# EAGLE design SparkFun_Thing_Plus_ESP32_WROOM_C (EAGLE 9.6.2)
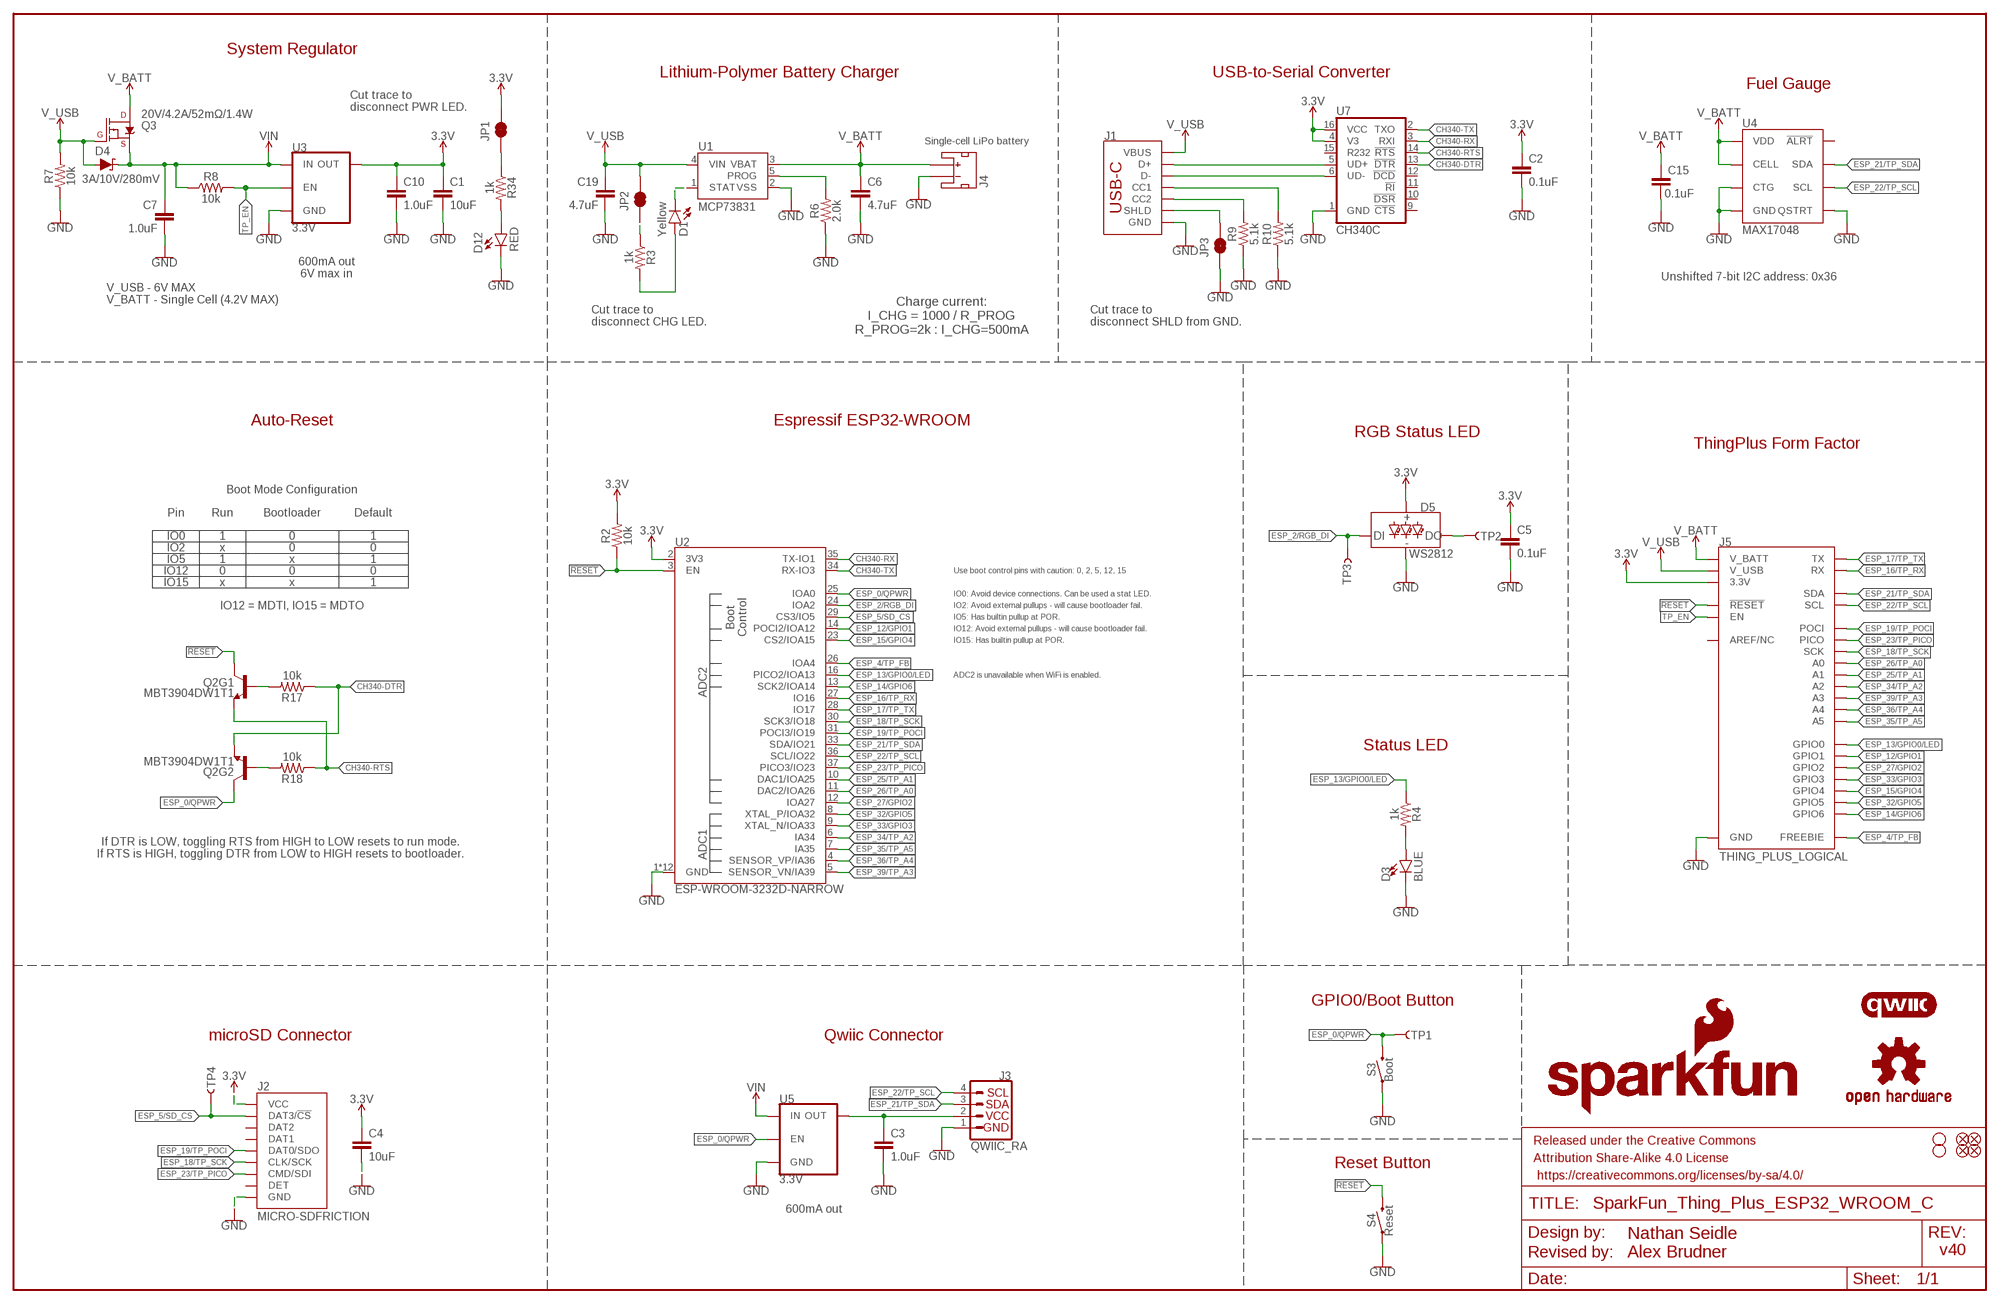
[diagram p0: schematic, sheet 1]

## Parts
C1  10uF  10UF-0402T-6.3V-20%  [0402-TIGHT]
C2  0.1uF  0.1UF-0402T-6.3V-10%-X7R  [0402-TIGHT]
C3  1.0uF  1.0UF-0402T-16V-10%  [0402-TIGHT]
C4  10uF  10UF-0402T-6.3V-20%  [0402-TIGHT]
C5  0.1uF  0.1UF-0402T-6.3V-10%-X7R  [0402-TIGHT]
C6  4.7uF  4.7UF-0402_TIGHT-6.3V-20%-X5R  [0402-TIGHT]
C7  1.0uF  1.0UF-0402T-16V-10%  [0402-TIGHT]
C10  1.0uF  1.0UF-0402T-16V-10%  [0402-TIGHT]
C15  0.1uF  0.1UF-0402T-16V-10%  [0402-TIGHT]
C19  4.7uF  4.7UF-0603-35V-(20%)  [0603]
D1  Yellow  LED-YELLOW0603  [LED-0603]
D3  BLUE  LED-BLUE0603  [LED-0603]
D4  3A/10V/280mV  DIODE-SCHOTTKY-BAT60A  [SOD-323]
D5  WS2812  WS2812_2020  [WS2812-2020]
D12  RED  LED-RED0603  [LED-0603]
FD1  FIDUCIALUFIDUCIAL  [FIDUCIAL-MICRO]
FD2  FIDUCIALUFIDUCIAL  [FIDUCIAL-MICRO]
FD3  FIDUCIALUFIDUCIAL  [FIDUCIAL-MICRO]
FD4  FIDUCIALUFIDUCIAL  [FIDUCIAL-MICRO]
FRAME1  FRAME-LEDGER  [CREATIVE_COMMONS]
H1  STAND-OFFTIGHT  [STAND-OFF-TIGHT]
H2  STAND-OFFTIGHT  [STAND-OFF-TIGHT]
J1  USB_C_2-LAYER_PADS  [USB-C-16P-2LAYER-PADS]
J2  MICRO-SDFRICTION  [MICROSD_TINY]
J3  QWIIC_RA  QWIIC_CONNECTORJS-1MM  [JST04_1MM_RA]
J4  JST_2MM_MALE  [JST-2-SMD]
J5  THING_PLUS_LOGICAL  [THING_PLUS]
JP1  JUMPER-SMT_2_NC_TRACE_SILK  [SMT-JUMPER_2_NC_TRACE_SILK]
JP2  JUMPER-SMT_2_NC_TRACE_SILK  [SMT-JUMPER_2_NC_TRACE_SILK]
JP3  JUMPER-SMT_2_NC_TRACE_SILK  [SMT-JUMPER_2_NC_TRACE_SILK]
LOGO1  SFE_LOGO_NAME_FLAME.1_INCH  [SFE_LOGO_NAME_FLAME_.1]
LOGO2  OSHW-LOGOMINI  [OSHW-LOGO-MINI]
LOGO4  QWIIC_LOGO_4MM  [QWIIC_4MM]
Q2  MBT3904DW1T1  TRANS_NPN_DUAL-MBT3904DW1T1  [SC70-6]
Q3  20V/4.2A/52mΩ/1.4W  MOSFET_PCH-DMG2305UX-7  [SOT23-3]
R2  10k  10KOHM-0402T-1/16W-1%  [0402-TIGHT]
R3  1k  1KOHM-0402T-1/16W-1%  [0402-TIGHT]
R4  1k  1KOHM-0402T-1/16W-1%  [0402-TIGHT]
R6  2.0k  2.0KOHM-0603-1/10W-5%  [0603]
R7  10k  10KOHM-0402T-1/16W-1%  [0402-TIGHT]
R8  10k  10KOHM-0402T-1/16W-1%  [0402-TIGHT]
R9  5.1k  5.1KOHM-0402T-1/16W-1%  [0402-TIGHT]
R10  5.1k  5.1KOHM-0402T-1/16W-1%  [0402-TIGHT]
R17  10k  10KOHM-0402T-1/16W-1%  [0402-TIGHT]
R18  10k  10KOHM-0402T-1/16W-1%  [0402-TIGHT]
R34  1k  1KOHM-0402T-1/16W-1%  [0402-TIGHT]
S3  Boot  MOMENTARY-SWITCH-SPST-SMD-4.6X2.8MM  [TACTILE_SWITCH_SMD_4.6X2.8MM]
S4  Reset  MOMENTARY-SWITCH-SPST-SMD-4.6X2.8MM  [TACTILE_SWITCH_SMD_4.6X2.8MM]
TP1  TEST-POINT3X5  [PAD.03X.05]
TP2  TEST-POINT3X5  [PAD.03X.05]
TP3  TEST-POINT3X5  [PAD.03X.05]
TP4  TEST-POINT3X5  [PAD.03X.05]
U1  MCP73831  [SOT23-5]
U2  ESP-WROOM-3232D-NARROW  [ESP-WROOM-32D-NARROW]
U3  3.3V  V_REG_AP2112K-3.3V  [SOT23-5]
U4  MAX17048  MAX17048DFN8  [DFN-8]
U5  3.3V  V_REG_AP2112K-3.3V  [SOT23-5]
U7  CH340C  [SO016]

## Nets
3.3V [power]: C1.1 C2.1 C4.1 C5.1 C10.1 D5.VCC J2.4(VCC) J5.27(3.3V) JP1.2 R2.2 U2.2(3V3) U3.5(OUT) U7.4(V3) U7.16(VCC)
!RESET!: J5.28(!RESET) Q2.3(C) R2.1 S4.3 S4.4 U2.3(EN)
CH340-DTR: Q2.1(E) R17.1 U7.13(!DTR)
CH340-RTS: Q2.4(E) R18.1 U7.14(!RTS)
CH340-RX: U2.35(TX-IO1) U7.3(RXI)
CH340-TX: U2.34(RX-IO3) U7.2(TXO)
CHG_LED: D1.A R3.2
D+: J1.A6(D+) J1.B6(D+) U7.5(UD+)
D-: J1.A7(D-) J1.B7(D-) U7.6(UD-)
DTR-10K: Q2.5(B) R17.2
ESP_0/QPWR: Q2.6(C) S3.3 S3.4 TP1.1 U2.25(IOA0) U5.3(EN)
ESP_2/RGB_DI: D5.DI TP3.1 U2.24(IOA2)
ESP_4/TP_FB: J5.13(FREEBIE) U2.26(IOA4)
ESP_5/SD_CS: J2.2(DAT3/!CS!) TP4.1 U2.29(CS3/IO5)
ESP_12/GPIO1: J5.8(GPIO1) U2.14(POCI2/IOA12)
ESP_13/GPIO0/LED: J5.9(GPIO0) R4.1 U2.16(PICO2/IOA13)
ESP_14/GPIO6: J5.3(GPIO6) U2.13(SCK2/IOA14)
ESP_15/GPIO4: J5.5(GPIO4) U2.23(CS2/IOA15)
ESP_16/TP_RX: J5.15(RX) U2.27(IO16)
ESP_17/TP_TX: J5.14(TX) U2.28(IO17)
ESP_18/TP_SCK: J2.5(CLK/SCK) J5.18(SCK) U2.30(SCK3/IO18)
ESP_19/TP_POCI: J2.7(DAT0/SDO) J5.16(POCI) U2.31(POCI3/IO19)
ESP_21/TP_SDA: J3.3 J5.1(SDA) U2.33(SDA/IO21) U4.8(SDA)
ESP_22/TP_SCL: J3.4 J5.2(SCL) U2.36(SCL/IO22) U4.7(SCL)
ESP_23/TP_PICO: J2.3(CMD/SDI) J5.17(PICO) U2.37(PICO3/IO23)
ESP_25/TP_A1: J5.23(A1) U2.10(DAC1/IOA25)
ESP_26/TP_A0: J5.24(A0) U2.11(DAC2/IOA26)
ESP_27/GPIO2: J5.7(GPIO2) U2.12(IOA27)
ESP_32/GPIO5: J5.4(GPIO5) U2.8(XTAL_P/IOA32)
ESP_33/GPIO3: J5.6(GPIO3) U2.9(XTAL_N/IOA33)
ESP_34/TP_A2: J5.22(A2) U2.6(IA34)
ESP_35/TP_A5: J5.19(A5) U2.7(IA35)
ESP_36/TP_A4: J5.20(A4) U2.4(SENSOR_VP/IA36)
ESP_39/TP_A3: J5.21(A3) U2.5(SENSOR_VN/IA39)
GND: C1.2 C2.2 C3.2 C4.2 C5.2 C6.2 C7.2 C10.2 C15.2 C19.2 D3.C D5.GND D12.C J1.GND J1.GND2(GND) J2.6(GND) J2.GND1(GND) J2.GND2(GND) J2.GND3(GND) J2.GND4(GND) J2.GND5(GND) J2.GND6(GND) J3.1 J4.1(-) J5.25(GND) JP3.1 R6.1 R7.1 R9.1 R10.1 S3.1 S3.2 S4.1 S4.2 U1.2(VSS) U2.1(GND) U2.15(GND) U2.38(GND) U2.GND1(GND) U2.GNDT1(GND) U2.GNDT2(GND) U2.GNDT3(GND) U2.GNDT4(GND) U2.GNDT5(GND) U2.GNDT6(GND) U2.GNDT7(GND) U2.GNDT8(GND) U3.2(GND) U4.1(CTG) U4.4(GND) U4.6(QSTRT) U4.9(GND) U5.2(GND) U7.1(GND)
N$1: JP1.1 R34.1
N$2: D3.A R4.2
N$3: D5.DO TP2.1
N$4: JP2.1 R3.1
N$5: J1.B5(CC2) R9.2
N$6: J1.A5(CC1) R10.2
N$7: D1.C U1.1(STAT)
N$8: J1.SHLD1(SHLD) J1.SHLD2(SHLD) J1.SHLD3(SHLD) J1.SHLD4(SHLD) JP3.2
N$14: R6.2 U1.5(PROG)
N$30: D12.A R34.2
QWIIC_PWR [power]: C3.1 J3.2 U5.5(OUT)
RTS-10K: Q2.2(B) R18.2
TP_EN: J5.11(EN) R8.2 U3.3(EN)
V_BATT [power]: C6.1 C15.1 J4.2(+) J5.12(V_BATT) Q3.3(D) U1.3(VBAT) U4.2(CELL) U4.3(VDD)
V_USB [power]: C19.1 D4.A J1.VBUS1(VBUS) J1.VBUS2(VBUS) J5.10(V_USB) JP2.2 Q3.1(G) R7.2 U1.4(VIN)
VIN [power]: C7.1 D4.C Q3.2(S) R8.1 U3.1(IN) U5.1(IN)
Unconnected: J2.1(DAT2) J2.8(DAT1) J2.9(DET) J4.NC1(PAD1) J4.NC2(PAD2) J5.26(AREF/NC) U4.5(!ALRT) U7.9(!CTS) U7.10(!DSR) U7.11(!RI) U7.12(!DCD) U7.15(R232)

## Notes on the sheet
- System Regulator
- Lithium-Polymer Battery Charger | USB-to-Serial Converter
- Fuel Gauge
- Cut trace to 
  disconnect PWR LED.
- Single-cell LiPo battery
- 600mA out
  6V max in
- Unshifted 7-bit I2C address: 0x36
- V_USB - 6V MAX
  V_BATT - Single Cell (4.2V MAX)
- Charge current:
  I_CHG = 1000 / R_PROG
  R_PROG=2k : I_CHG=500mA
- Cut trace to 
  disconnect CHG LED.
- Cut trace to 
  disconnect SHLD from GND.
- Auto-Reset | Espressif ESP32-WROOM
- RGB Status LED
- ThingPlus Form Factor
- Boot Mode Configuration
- Pin | Run | Bootloader | Default
- IO0 | 1 | 0 | 1
- IO2 | x | 0 | 0
- IO5 | 1 | x | 1
- IO12 | 0 | 0 | 0 | Use boot control pins with caution: 0, 2, 5, 12, 15
- IO15 | x | x | 1
- IO0: Avoid device connections. Can be used a stat LED.
- IO12 = MDTI, IO15 = MDTO | IO2: Avoid external pullups - will cause bootloader fail.
- IO5: Has builtin pullup at POR.
- IO12: Avoid external pullups - will cause bootloader fail.
- IO15: Has builtin pullup at POR.
- ADC2 is unavailable when WiFi is enabled.
- Status LED
- If DTR is LOW, toggling RTS from HIGH to LOW resets to run mode.
  If RTS is HIGH, toggling DTR from LOW to HIGH resets to bootloader.
- GPIO0/Boot Button
- microSD Connector | Qwiic Connector
- Reset Button
- 600mA out
- v40

## Library data of the parts
C1 C4 = SparkFun-Capacitors:10UF: 10.0µF ceramic capacitors A capacitor is a passive two-terminal electrical component used to store electrical energy temporarily in an electric field.; PROD_ID: CAP-14848
C2 C5 = SparkFun-Capacitors:0.1UF: 0.1µF ceramic capacitors A capacitor is a passive two-terminal electrical component used to store electrical energy temporarily in an electric field.; PROD_ID: CAP-14993
C3 C7 C10 = SparkFun-Capacitors:1.0UF: 1µF ceramic capacitors A capacitor is a passive two-terminal electrical component used to store electrical energy temporarily in an electric field.; PROD_ID: CAP-12417
C6 = SparkFun-Capacitors:4.7UF: 4.7µF ceramic capacitors A capacitor is a passive two-terminal electrical component used to store electrical energy temporarily in an electric field.; PROD_ID: CAP-14240
C15 = SparkFun-Capacitors:0.1UF: 0.1µF ceramic capacitors A capacitor is a passive two-terminal electrical component used to store electrical energy temporarily in an electric field.; PROD_ID: CAP-12416
C19 = SparkFun-Capacitors:4.7UF: 4.7µF ceramic capacitors A capacitor is a passive two-terminal electrical component used to store electrical energy temporarily in an electric field.; PROD_ID: CAP-14106
D1 = SparkFun-LED:LED-YELLOW: Yellow SMD LED Used in manufacturing several products at SparkFun. Packages: 0603 - SMD 0603 package[Product Link] <http://www.kingbrightusa.com/product.asp?catalog_name=LED&product_id=APT1608SYCK> 0603 -SMART - SMART SMD 0603 package (more efficient/more expensive) [Product Link] <http://www.osram-os.com/osram_os/en/products/product-catalog/led-light-emitting-diodes/smartled-0603/ly-l29k/index.jsp> LilyPad - SMD1206 package[Product Datasheet] <https://www.sparkfun.com/datasheets/DevTools/LilyPad/Q150YUS4.pdf> SparkFun Products: Blynk Board <https://www.sparkfun.com/products/13794> IOIO-OTG <https://www.sparkfun.com/products/13613> XBee Explorer Serial <https://www.sparkfun.com/products/13225>; PROD_ID: DIO-09003
D3 = SparkFun-LED:LED-BLUE: Blue SMD LED Used in manufacturing of various products at SparkFun Packages: 0603 - SMD 0603 package [Product Link] <http://www.digikey.com/product-detail/en/SMLE12BC7TT86/511-1589-2-ND/1641808> 1206 - SMD1206 package [Product Link] <http://www.digikey.com/product-detail/en/lite-on-inc/LTST-C150TBKT/160-1643-1-ND/573584> SparkFun Products: ESP8266 Thing-Dev Board <https://www.sparkfun.com/products/13711> RedBoard <https://www.sparkfun.com/products/12757>; PROD_ID: DIO-08575
D4 = SparkFun-DiscreteSemi:DIODE-SCHOTTKY: Schottky diode A Schottky diode is a semiconductor diode which has a low forward voltage drop and a very fast switching action.; PROD_ID: DIO-14072
D5 = SparkFun-LED:WS2812: Addressable RGB LED - 1 Wire Common names: WS2812, SK6812, Neopixel, APA-106, etc. SMD LED with built-in controller IC. Color: Red/Green/Blue SparkFun Products: LED-SMD RGB (WS2812) <https://www.sparkfun.com/products/11821> LED - RGB Addressable, PTH, 5mm Diffused (5 Pack) <https://www.sparkfun.com/products/12986> LED - RGB Addressable, PTH, 5mm Clear (5 Pack) <https://www.sparkfun.com/products/12999> Blynk Board - ESP8266 <https://www.sparkfun.com/products/13794> Datasheet referenced for footprint: WS2812B-PTH <https://cdn.sparkfun.com/datasheets/Components/LED/COM-12877.pdf>; PROD_ID: DIO-15591
D12 = SparkFun-LED:LED-RED: Red SMD LED Used in manufacturing of most products at SparkFun Packages: 0603 - SMD 0603 package [Product Link] <http://docs.avagotech.com/docs/AV02-0551EN> 0603 SMART - SMD 0603 SMART package ( more efficient and expensive)[Product Link] <http://www.osram-os.com/Graphics/XPic2/00077099_0.pdf> 1206 - SMD1206 package [Product Link] <https://www.sparkfun.com/datasheets/DevTools/LilyPad/Q150OVS4.pdff> SparkFun Products: Pro Mini 328 -5V <https://www.sparkfun.com/products/821> RedBoard <https://www.sparkfun.com/products/12757> IOIO-OTG <https://www.sparkfun.com/products/13613>; PROD_ID: DIO-00819
FD1-FD4 = SparkFun-Aesthetics:FIDUCIAL: Fiducial Alignment Points Point-of-reference for pick-and-place machines and other optical instruments.
FRAME1 = SparkFun-Aesthetics:FRAME-LEDGER: Schematic Frame - Ledger Standard 11x14 US Ledger frame; DESIGNER: Nathan Seidle; REV_BY: Revised by:; REV_DES: Alex Brudner
H1 H2 = SparkFun-Hardware:STAND-OFF: Stand Off Drill holes for mechanically mounting via screws, standoffs, etc. Note: Use the keepout ring to avoid running the screw head into surrounding components. Variant Overviews STAND-OFF - Mechanical footprint for a #4 phillips button head screw. STAND-OFF-TIGHT - Mechanical footprint for a #4 phillips button head screw, Example SparkFun Products Screw - Phillips Head (1/4", 4-40, 10 pack) (PRT-10453) Screw - Phillips Head (1/2", 4-40, 10 pack) (PRT-10452) Screw - Phillips Head (3/4", 4-40, 10 pack) (PRT-10451) Screw - Phillips Head (1", 4-40, 10 pack) (PRT-10450)
J1 = SparkFun-Connectors:USB_C: USB Type C 16Pin Connector Super Speed pins not available on the 16-pin purely SMD connector so this part is best for USB 2.0 implementations. D1 and D2 are tied together enabling D+/- no matter which way the cable is plugged into the connector. The two channel configuration pins (CC1/2) are exposed. These are normally connected to ground via 5.1k resistors but can be reconfigured for high current/high power applications. **4-LAYER BOARD WARNING!!** If designing 4-layer board, make sure to select the variant _4-LAYER-ISOLATED. The linked footprint (USB-C-16-4LAYER-ISOLATED) includes some very necessary cutout polygons in the inner layers (2 and 15). This prevents the PTH mounting shield legs on the USB connector from electrically connecting any other polygons on the inner layers (usually VCC and GND).; PROD_ID: CONN-14122
J2 = SparkFun-Connectors:MICRO-SD: microSD Socket for Transflash Various sockets for µSD. tDoc lines correctly indicate media card edge positions when inserting (unlocked, locked, depressed). NOTE: CD1 and CD2 are connected internally, and the default detect state of the socket is detect pin to ground. SparkFun Products: WAV Trigger <https://www.sparkfun.com/products/13660> CAN-Bus Shield <https://www.sparkfun.com/products/13262> SparkFun Level Shifing microSD Breakout <https://www.sparkfun.com/products/13743>; PROD_ID: CONN-13500
J3 = SparkFun-Connectors:QWIIC_CONNECTOR: SparkFun I2C Standard Qwiic Connector An SMD 1mm pitch JST connector makes it easy and quick (get it? Qwiic?) to connect I2C devices to each other. The Qwiic system <http://www.sparkfun.com/qwiic> enables fast and solderless connection between popular platforms and various sensors and actuators. We carry 200mm <https://www.sparkfun.com/products/14204>, 100mm <https://www.sparkfun.com/products/14205>, 50mm <https://www.sparkfun.com/products/14206>, and breadboard friendly <https://www.sparkfun.com/products/14207> Qwiic cables. We also offer 10 pcs strips <https://www.sparkfun.com/products/14323> the SMD connectors.; PROD_ID: CONN-13694; VALUE: QWIIC_RIGHT_ANGLE
J4 = SparkFun-Connectors:JST_2MM_MALE: JST 2MM MALE RA CONNECTOR Two pin, compact surface mount connector. Commonly used as a battery input connection point. We really like the solid locking feeling and high current rating on these small connectors. We use these all the time as battery connectors. Mates to single-cell LiPo batteries. Here is the connector we sell at SparkFun: JST Right Angle Connector - White (PRT-08612) Datasheet It was used on these SparkFun products: SparkFun MOSFET Power Controller (PRT-11214) SparkFun Battery Babysitter - LiPo Battery Manager (PRT-13777) And many, many others that required a lipo battery connection.; PROD_ID: CONN-11443; SF_ID: PRT-08612
J5 = SparkFun-Boards:THING_PLUS_LOGICAL
JP1-JP3 = SparkFun-Jumpers:JUMPER-SMT_2_NC_TRACE: Normally closed trace jumper This jumper has a trace between two pads so it's normally closed (NC). Use a razor knife to open the connection. For best results follow the IPC guidelines for cutting traces: Cutout at least 0.063 mm (0.005 in). Remove all loose material to clean up the cut area. Seal the cut with an approved epoxy. Reapply solder to reclose the connection.
LOGO1 = SparkFun-Aesthetics:SFE_LOGO_NAME_FLAME: SparkFun Font Logo w/ Flame This is the SparkFun full logo. The logo on the schematic will always be the same size; the package variant is the height of the flame part of the logo. Default layer for the logo on the board is tSilk.
LOGO2 = SparkFun-Aesthetics:OSHW-LOGO: Open-Source Hardware (OSHW) Logo This logo indicates the piece of hardware it is found on incorporates a OSHW license and/or adheres to the definition of open source hardware found here: http://freedomdefined.org/OSHW
LOGO4 = SparkFun-Aesthetics:QWIIC_LOGO: Qwiic Logos for placement on schematic and PCB. The 5.5mm silk logo is best for placing next to Qwiic connector.
Q2 = SparkFun-DiscreteSemi:TRANS_NPN_DUAL: Dual NPN Transistors in Single Package The MBT3904W1 puts two general purpose 3904 NPN transistors in a single package. Datasheet <http://www.onsemi.com/pub_link/Collateral/MBT3904DW1T1-D.PDF> SparkFun Products: SparkFun ESP32 Thing <https://www.sparkfun.com/products/13907>; PROD_ID: TRANS-13337
Q3 = SparkFun-DiscreteSemi:MOSFET_PCH: P-channel MOSFETs Voltage controlled devices that allow control of high current outputs. SparkFun Products: SparkFun ESP32 Thing <https://www.sparkfun.com/products/13907> SparkFun ESP8266 Thing <https://www.sparkfun.com/products/13231> SparkFun Pi Servo HAT V2 <https://www.sparkfun.com/products/15316> DMG2305UX-7 (20V/4.2A/SOT23-3); PROD_ID: TRANS-14388
R2 R7 R8 R17 R18 = SparkFun-Resistors:10KOHM: 10kΩ resistor A resistor is a passive two-terminal electrical component that implements electrical resistance as a circuit element. Resistors act to reduce current flow, and, at the same time, act to lower voltage levels within circuits. - Wikipedia; PROD_ID: RES-14241
R3 R4 R34 = SparkFun-Resistors:1KOHM: 1kΩ resistor A resistor is a passive two-terminal electrical component that implements electrical resistance as a circuit element. Resistors act to reduce current flow, and, at the same time, act to lower voltage levels within circuits. - Wikipedia; PROD_ID: RES-14342
R6 = SparkFun-Resistors:2.0KOHM: 2kΩ resistor A resistor is a passive two-terminal electrical component that implements electrical resistance as a circuit element. Resistors act to reduce current flow, and, at the same time, act to lower voltage levels within circuits. - Wikipedia; PROD_ID: RES-08296
R9 R10 = SparkFun-Resistors:5.1KOHM; PROD_ID: RES-14340
S3 S4 = SparkFun-Switches:MOMENTARY-SWITCH-SPST: Momentary Switch (Pushbutton) - SPST Normally-open (NO) SPST momentary switches (buttons, pushbuttons). Variants PTH-12MM - 12mm square, through-hole Momentary Pushbutton Switch - 12mm Square (COM-09190) PTH-6.0MM, PTH-6.0MM-KIT - 6.0mm square, through-hole Mini Pushbutton Switch (COM-00097) KIT package intended for soldering kit's - only one side of pads' copper is exposed. PTH-RIGHT-ANGLE-KIT - Right-angle, through-hole Right Angle Tactile Button - Used on SparkFun BigTime Watch Kit SMD-12MM - 12mm square, surface-mount Tactile Button - SMD (12mm) (COM-12993) Used on SparkFun PicoBoard SMD-4.5MM - 4.5mm Square Trackball Switch Used on SparkFun Blackberry Trackballer Breakout SMD-4.6MMX2.8MM - 4.60mm x 2.80mm, surface mount Used on SparkFun Pro Micro - RP2040 SMD-5.2MM, SMD-5.2-REDUNDANT - 5.2mm square, surface-mount Mini Pushbutton Switch - SMD (COM-08720) Used on Arduino Pro Mini REDUNDANT package connects both switch circuits together SMD-6.0X3.5MM - 6.0 x 3.5mm, surface mount Momentary Reset Switch SMD (COM-08229) SMD-6.2MM-TALL - 6.2mm square, surface mount Tactile Button - SMD (6mm) Used on SparkFun Digital Sandbox SMD-RIGHT-ANGLE - Right-angle, surface mount Used on SparkFun Block for Intel® Edison - Arduino; PROD_ID: SWCH-15606
TP1-TP4 = SparkFun-Connectors:TEST-POINT: SparkFun Test Points Bare copper test points for troubleshooting or In-Circuit-Testing. These are used by our Production team for verifying production board runs using pogo-pins on test beds. SparkFun Products: SparkFun LSM9DS1 Breakout <https://www.sparkfun.com/products/13284> SparkFun PSOC <https://www.sparkfun.com/products/13714> SparkFun Load Cell Amplifier <https://www.sparkfun.com/products/13879>
U1 = SparkFun-IC-Power:MCP73831: MCP73831T Li-Ion, Li-Pol Controller Miniature single cell, fully integrated Li-Ion, Li-polymer charge management controller Datasheet <http://ww1.microchip.com/downloads/en/DeviceDoc/20001984g.pdf> SparkFun Products: SparkFun ESP32 Thing <https://www.sparkfun.com/products/13907> SparkFun 9DoF Razor IMU M0 <https://www.sparkfun.com/products/14001>; PROD_ID: IC-09995
U2 = SparkFun-RF:ESP-WROOM-32: ESP-WROOM-32D - trace antenna (includes keepout) ESP-WROOM-32U - U.FL antenna connector Includes both "standard" footprints and "narrow" version (for use with tighter layouts).; PROD_ID: IC-15676
U3 U5 = SparkFun-IC-Power:V_REG_AP2112: AP2112 - 600mA CMOS LDO Regulator w/ Enable The AP2112 is CMOS process low dropout linear regulator with enable function, the regulator delivers a guaranteed 600mA (min.) continuous load current. Features Output Voltage Accuracy: ±1.5% Output Current: 600mA (Min.) Foldback Short Current Protection: 50mA Enable Function to Turn ON/OFF VOUT Low Dropout Voltage (3.3V): 250mV (Typ.) @IOUT=600mA Excellent Load Regulation: 0.2%/A (Typ.) Excellent Line Regulation: 0.02%/V (Typ.) Low Quiescent Current: 55μA (Typ.) Low Standby Current: 0.01μA (Typ.) Low Output Noise: 50μVRMS PSRR: 100Hz -65dB, 1kHz -65dB OTSD Protection Stable with 1.0μF Flexible Cap: Ceramic, Tantalum and Aluminum Electrolytic Operation Temperature Range: -40°C to 85°C ESD: MM 400V, HBM 4000V; PROD_ID: VREG-12457
U4 = SparkFun-IC-Power:MAX17048: Micropower 1-Cell Li+ ModelGauge SparkFun Products Qduino Mini (DEV-13614); PROD_ID: IC-12551
U7 = SparkFun-IC-Comms:CH340C; PROD_ID: IC-14038

## Net classes
0 default: width 0.127 mm, drill 0.305 mm
1 power: width 0.305 mm, drill 0.305 mm

## Board
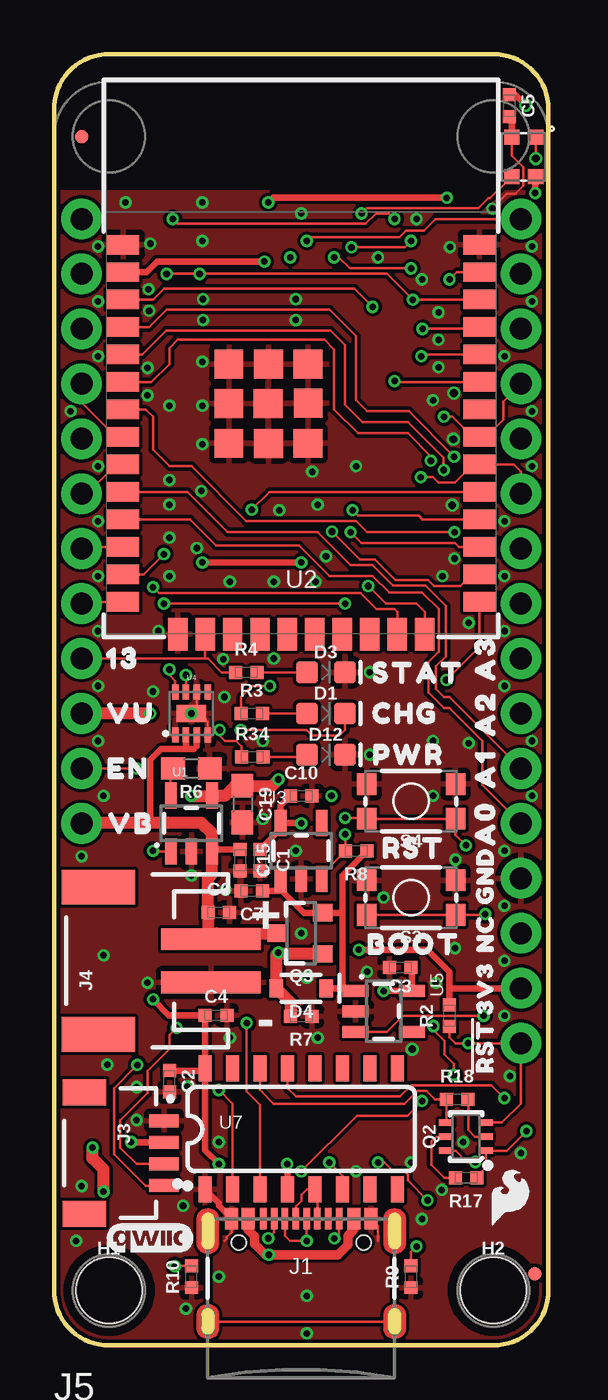
[diagram p1: board, top side]
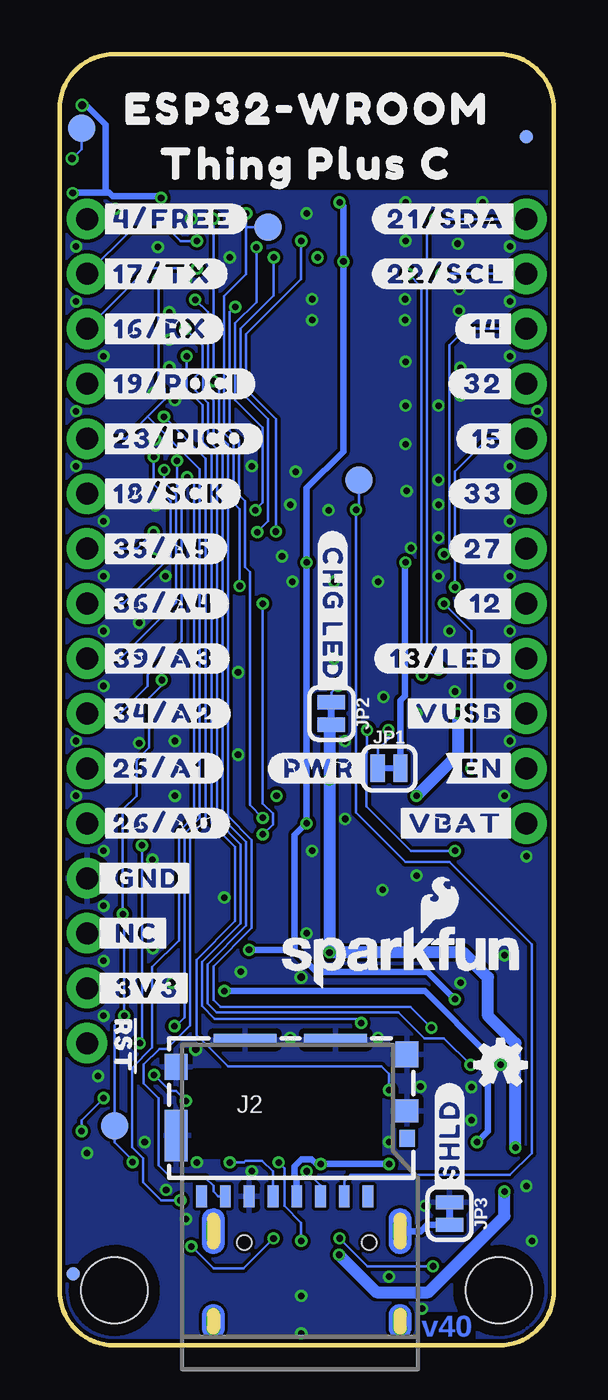
[diagram p2: board, bottom side, seen from below]

Size 22.86 x 59.69 mm. Coordinates in mm from the lower left corner, seen from the top.
Outline: 22.86,2.54 22.86,57.15 arc90 20.32,59.69 2.54,59.69 arc90 0,57.15 0,2.54 arc90 2.54,0 20.32,0 arc90 22.86,2.54
Copper layers (1*16): Top/Horz 0.035mm / dielectric 1.5mm / Bottom/Vert 0.035mm
Design rules "SparkFun-2-Layer-Minimum-JLCPCB": minimum track width 5mil, minimum drill 0.3mm, track to track 5mil, track to pad 5mil, pad to pad 5mil, via to via 5mil, smd to smd 5mil, copper to edge 7mil, drill to drill 7mil, minimum pad ring 5mil, minimum via ring 5mil, stop-mask expansion 4mil, vias tented up to drill 25mil, thermal gap 10mil
tRestrict: area 6.2,26.5 to 6.4,27; area 7.8,23.9 to 8,24.4

### Footprints (pad centres in the part's own frame; a part is rotated, then mirrored left to right if it is on the bottom)
0402-TIGHT = smd 0.6 x 0.6: 1 -0.5,0; 2 0.5,0
0603 = smd 1.1 x 1: 1 -0.85,0; 2 0.85,0
LED-0603 = smd 1 x 1: A -0.877,0; C 0.877,0
SOD-323 = smd 0.63 x 0.83: A 1.15,0; C -1.15,0
WS2812-2020 = smd 0.7 x 0.7: DI -0.915,0.55; DO 0.915,-0.55; GND 0.915,0.55; VCC -0.915,-0.55
FIDUCIAL-MICRO = smd 0.635 x 0.635: 1 0,0
STAND-OFF-TIGHT = hole 3.048: 0,0
USB-C-16P-2LAYER-PADS = smd 0.3 x 1: A5 -1.25,-0.34; A6 -0.25,-0.34; A7 0.25,-0.34; A8 1.25,-0.34; B5 1.75,-0.34; B6 0.75,-0.34; B7 -0.75,-0.34; B8 -1.75,-0.34 | smd 0.6 x 1: GND -3.225,-0.34; GND2 3.225,-0.34; VBUS1 -2.45,-0.34; VBUS2 2.45,-0.34 | drill 0.4 pad 0.6 long: SHLD1 -4.318,-0.915; SHLD2 4.318,-0.915; SHLD3 -4.318,-5.095; SHLD4 4.318,-5.095 | hole 0.65: -2.89,-1.445; 2.89,-1.445
MICROSD_TINY = smd 0.5 x 1: 1 3.55,-3.85; 2 2.45,-3.85; 3 1.35,-3.85; 4 0.25,-3.85; 5 -0.85,-3.85; 6 -1.95,-3.85; 7 -3.05,-3.85; 8 -4.15,-3.85 | smd 0.72 x 0.78: 9 5.35,-1.17 | smd 1.05 x 1.08: GND1 5.35,0.1 | smd 1.05 x 1.2: GND2 5.35,2.71; GND3 -5.325,2.14 | smd 1.05 x 2.39: GND4 -5.325,-1.045 | smd 2.91 x 0.55: GND5 -2.145,3.385; GND6 2.045,3.385
JST04_1MM_RA = smd 0.6 x 1.35: 1 -1.5,0; 2 -0.5,0; 3 0.5,0; 4 1.5,0 | smd 1.2 x 2: NC1 2.8,-3.675; NC2 -2.8,-3.675
JST-2-SMD = smd 1 x 4.6: 1 -1,-3.7; 2 1,-3.7 | smd 1.6 x 3.4: NC1 -3.4,1.5; NC2 3.4,1.5
THING_PLUS = drill 1.016 pad 1.88: 1 1.27,52.07; 2 1.27,49.53; 3 1.27,46.99; 4 1.27,44.45; 5 1.27,41.91; 6 1.27,39.37; 7 1.27,36.83; 8 1.27,34.29; 9 1.27,31.75; 10 1.27,29.21; 11 1.27,26.67; 12 1.27,24.13; 13 21.59,52.07; 14 21.59,49.53; 15 21.59,46.99; 16 21.59,44.45; 17 21.59,41.91; 18 21.59,39.37; 19 21.59,36.83; 20 21.59,34.29; 21 21.59,31.75; 22 21.59,29.21; 23 21.59,26.67; 24 21.59,24.13; 25 21.59,21.59; 26 21.59,19.05; 27 21.59,16.51; 28 21.59,13.97
SMT-JUMPER_2_NC_TRACE_SILK = smd 0.66 x 1.27: 1 -0.521,0; 2 0.521,0
SC70-6 = smd 0.3 x 0.66: 1 -0.65,-0.92; 2 0,-0.92; 3 0.65,-0.92; 4 0.65,0.92; 5 0,0.92; 6 -0.65,0.92
SOT23-3 = smd 0.8 x 0.9: 1 -0.95,-1; 2 0.95,-1; 3 0,1.1
TACTILE_SWITCH_SMD_4.6X2.8MM = smd 0.9 x 1: 1 -2.05,-0.8; 2 2.05,-0.8; 3 2.05,0.8; 4 -2.05,0.8
PAD.03X.05 = smd 1.27 x 1.27: 1 0,0
SOT23-5 = smd 0.55 x 1.2: 1 -0.95,-1.3; 2 0,-1.3; 3 0.95,-1.3; 4 0.95,1.3; 5 -0.95,1.3
ESP-WROOM-32D-NARROW = smd 0.9 x 1.5: 1 6.43,8.238; 2 5.16,8.238; 3 3.89,8.238; 4 2.62,8.238; 5 1.35,8.238; 6 0.08,8.238; 7 -1.19,8.238; 8 -2.46,8.238; 9 -3.73,8.238; 10 -5,8.238; 11 -6.27,8.238; 12 -7.54,8.238; 13 -8.81,8.238; 14 -10.08,8.238; 25 -10.08,-8.238; 26 -8.81,-8.238; 27 -7.54,-8.238; 28 -6.27,-8.238; 29 -5,-8.238; 30 -3.73,-8.238; 31 -2.46,-8.238; 32 -1.19,-8.238; 33 0.08,-8.238; 34 1.35,-8.238; 35 2.62,-8.238; 36 3.89,-8.238; 37 5.16,-8.238; 38 6.43,-8.238 | smd 1.5 x 0.9: 15 -11.57,5.715; 16 -11.57,4.445; 17 -11.57,3.175; 18 -11.57,1.905; 19 -11.57,0.635; 20 -11.57,-0.635; 21 -11.57,-1.905; 22 -11.57,-3.175; 23 -11.57,-4.445; 24 -11.57,-5.715 | smd 1.33 x 1.33: GND1 -0.912,1.531; GNDT1 -2.751,3.346; GNDT2 -2.761,1.516; GNDT3 -2.751,-0.314; GNDT4 -0.891,-0.324; GNDT5 0.909,-0.314; GNDT6 0.909,1.516; GNDT7 0.909,3.346; GNDT8 -0.921,3.346
DFN-8 = smd 0.3 x 0.7: 1 -0.75,-0.99; 2 -0.25,-0.99; 3 0.25,-0.99; 4 0.75,-0.99; 5 0.75,0.99; 6 0.25,0.99; 7 -0.25,0.99; 8 -0.75,0.99 | smd 1.38 x 0.8: 9 0,0
SO016 = smd 0.6 x 1.2: 1 -4.445,-2.8; 2 -3.175,-2.8; 3 -1.905,-2.8; 4 -0.635,-2.8; 5 0.635,-2.8; 6 1.905,-2.8; 7 3.175,-2.8; 8 4.445,-2.8; 9 4.445,2.8; 10 3.175,2.8; 11 1.905,2.8; 12 0.635,2.8; 13 -0.635,2.8; 14 -1.905,2.8; 15 -3.175,2.8; 16 -4.445,2.8

### Placement (x,y rotation side)
C1  9.53,22.43 270 top
C2  5.33,12.22 270 top
C3  16,17.48 180 top
C4  7.49,15.27 0 top
C5  21.06,57.3 270 top
C6  7.62,20.02 0 top
C7  9.14,21.01 180 top
C10  11.43,25.4 0 top
C15  8.61,22.43 270 top
C19  8.71,25.02 270 top
D1  12.57,29.21 0 top
D3  12.57,31.11 0 top
D4  11.43,16.51 180 top
D5  21.72,54.94 90 top
D12  12.57,27.3 0 top
FD1  1.27,55.88 0 top
FD2  1.27,55.88 0 bottom
FD3  22.23,3.3 0 top
FD4  22.23,3.3 0 bottom
FRAME1  -17.14,-19.05 0 top  (outside the outline)
H1  2.54,2.54 0 top
H2  20.32,2.54 0 top
J1  11.43,6.2 0 top
J2  12.14,10.74 0 bottom
J3  5.08,8.89 270 top
J4  3.56,17.78 90 top
J5  0,0 0 top
JP1  7.62,26.67 0 bottom
JP2  10.29,29.21 270 bottom
JP3  4.83,6.1 270 bottom
LOGO1  7.01,17.96 0 bottom
LOGO2  2.46,12.98 0 bottom
LOGO4  4.45,4.95 0 top
Q2  19.05,9.65 90 top
Q3  11.43,19.05 90 top
R2  18.29,15.24 90 top
R3  9.14,29.21 0 top
R4  8.89,31.11 0 top
R6  6.35,26.67 180 top
R7  11.43,15.21 180 top
R8  13.97,22.86 180 top
R9  16.51,3.17 90 top
R10  6.35,3.17 90 top
R17  19.05,7.75 180 top
R18  18.64,11.38 0 top
R34  9.17,27.2 0 top
S3  16.51,20.7 180 top
S4  16.51,25.15 180 top
TP1  20.32,10.16 0 bottom
TP2  21.84,56.26 0 bottom
TP3  13.21,51.69 0 bottom
TP4  9.02,40.01 0 bottom
U1  6.35,24.13 0 top
U2  11.43,44.45 90 top
U3  11.43,22.86 0 top
U4  6.35,29.21 0 top
U5  15.24,15.44 270 top
U7  11.43,10.01 0 top
U$1  [SFE_LOGO_FLAME_STOP_.1]  21.34,6.86 0 bottom
U$2  [#23#PICO#0]  21.08,41.91 0 bottom
U$3  [#19#POCI#0]  21.08,44.45 0 bottom
U$4  [#4#FREE#0]  21.08,52.07 0 bottom
U$5  [#CHG_LED#0]  10.24,37.62 270 bottom
U$6  [ESP32#WROOM0]  11.43,57.15 0 bottom
U$7  [THING_PLUS_C0]  11.43,54.61 0 bottom
U$8  [#SHLD#0]  4.83,6.93 90 bottom
U$9  [#_GND#0]  21.34,21.59 0 bottom
U$10  [#_NC#0]  21.34,19.05 0 bottom
U$11  [#_3V3#0]  21.34,16.51 0 bottom
U$12  [SFE_LOGO_FLAME_.1]  21.08,6.86 0 top
U$23  [3V30]  19.94,16.51 90 top
U$24  [CHG1]  16.23,29.21 0 top
U$25  [PWR2]  16.38,27.3 0 top
U$26  [STAT0]  16.84,31.09 0 top
U$68  [A03]  19.94,24.13 90 top
U$69  [A12]  19.94,26.67 90 top
U$70  [A21]  19.94,29.21 90 top
U$71  [A30]  19.94,31.75 90 top
U$72  [#17#TX#0]  21.08,49.53 0 bottom
U$73  [VB1]  3.56,24.13 0 top
U$74  [EN3]  3.43,26.67 0 top
U$75  [GND1]  19.94,21.72 90 top
U$76  [VU0]  3.56,29.21 0 top
U$77  [130]  3.17,31.75 0 top
U$78  [BOOT0]  16.64,18.54 0 top
U$79  [#RST#0]  19.81,13.84 90 top
U$80  [RST0]  16.64,22.99 0 top
U$81  [#16#RX#0]  21.08,46.99 0 bottom
U$83  [#18#SCK#0]  21.08,39.37 0 bottom
U$84  [#35#A5#0]  21.08,36.83 0 bottom
U$85  [#36#A4#0]  21.08,34.29 0 bottom
U$86  [#25#A1#2]  21.08,26.67 0 bottom
U$87  [#26#A0#3]  21.08,24.13 0 bottom
U$88  [#34#A2#1]  21.08,29.21 0 bottom
U$89  [#39#A3#0]  21.08,31.75 0 bottom
U$90  [#12#4]  1.65,34.29 0 bottom
U$91  [#14#9]  1.65,46.99 0 bottom
U$92  [#15#7]  1.65,41.91 0 bottom
U$93  [#27#5]  1.65,36.83 0 bottom
U$94  [#32#8]  1.65,44.45 0 bottom
U$95  [#33#6]  1.65,39.37 0 bottom
U$96  [#EN#1]  1.65,26.67 0 bottom
U$97  [#VBAT#0]  1.65,24.13 0 bottom
U$98  [#VUSB#2]  1.65,29.21 0 bottom
U$99  [#13#LED#0]  1.65,31.75 0 bottom
U$100  [#21#SDA#1]  1.52,52.07 0 bottom
U$101  [#22#SCL#0]  1.52,49.53 0 bottom
U$102  [#PWR#0]  8.51,26.67 0 bottom
U$107  [NC0]  19.94,19.05 90 top
U$109  [#RST#0]  19.81,13.84 270 bottom

### Tracks (layer width: path | path; a pad name or v marks a point on that pad's centre or on a via)
3.3V  (via drill 0.3, 0.35)
  Top/Horz 0.305: v9.73,50.1 4.76,50.1 4.27,49.61 U2.2 | v18.16,53.05 10.12,53.05 v9.91,52.83 | v14.1,18.29 17.27,18.29 18.29,17.27 18.29,16.51 | 6.99,12.7 U7.16 6.99,9.02 v7.62,8.38 | v6.86,36.2 v11.43,36.2 | R2.2 18.29,16.51 | C2.1 5.35,12.7 6.99,12.7 | v4.57,16 5.31,15.27 C4.1 6.99,12.71 6.99,12.7 | v10.78,8.38 10.79,8.37 U7.4 | C10.1 10.48,24.95 U3.5 | U3.5 11.4,24.16 v11.43,24.13 | C5.1 21.34,57.8 v21.81,57.33 | C1.1 10.48,23.88 U3.5 | J5.27 18.29,16.51 | v22.25,53.26 22.25,54.01 D5.VCC
  Bottom/Vert 0.305: v9.91,52.83 9.73,52.65 v9.73,50.1 9.74,50.09 9.74,41.31 11.43,39.62 v11.43,36.2 v11.43,24.13 11.46,24.13 11.99,23.6 11.99,18.29 | v18.16,53.05 18.24,53.12 20.4,53.12 20.56,53.29 20.73,53.29 | JP1.2 7.1,29.82 6.9,30.02 6.9,36.16 v6.86,36.2 | v14.1,18.29 11.99,18.29 | v4.57,16 5.84,17.27 10.97,17.27 11.99,18.29 | v7.62,8.38 v10.78,8.38 10.97,8.38 11.2,8.61 11.66,8.61 11.99,8.28 11.99,7.82 11.89,7.72 J2.4 | v21.81,57.33 21.62,57.33 20.73,56.44 20.73,53.29 | v22.25,53.26 22.12,53.26 22.09,53.29 20.73,53.29
!RESET!  (via drill 0.3)
  Top/Horz 0.127: v19.05,23.11 18.56,23.6 S4.4 S4.3 14.42,24.38 v13.46,24.38 | v14.73,48.01 13.89,48.85 5.1,48.85 4.59,48.34 U2.3 | R2.1 18.29,14.23 18.55,13.97 v19.15,13.97 J5.28 21.59,11.18 20.72,10.3 Q2.3
  Bottom/Vert 0.127: v19.05,23.11 19.05,14.07 v19.15,13.97 | v14.73,48.01 14.99,47.75 14.99,42.28 14.57,41.86 14.57,39.31 14.28,39.02 14.28,35.97 14.06,35.76 14.06,24.98 v13.46,24.38
CH340-DTR  (via drill 0.3)
  Top/Horz 0.127: R17.1 19.55,7.82 19.97,8.24 Q2.1 20.94,9 v21.84,9.91 | U7.13 10.79,11.89 11.18,11.51 16,11.51 16.52,12.02 20.23,12.02 v20.83,11.43
  Bottom/Vert 0.127: v20.83,11.43 21.84,10.41 v21.84,9.91
CH340-RTS
  Top/Horz 0.127: Q2.4 18.14,10.32 R18.1 17.6,11.38 17.21,11.77 16.8,11.77 16.2,11.18 10.16,11.18 9.53,11.81 U7.14
CH340-RX  (via drill 0.3)
  Top/Horz 0.127: U7.3 9.53,11.13 8.91,11.75 v8.91,14.9 | U2.35 19.59,46.99 v17.04,46.99
  Bottom/Vert 0.127: v17.04,46.99 16.26,46.2 16.26,45.09 16.58,44.77 16.57,44.77 16.57,44.13 | v8.91,14.9 9.11,15.1 15.69,15.1 16.27,15.68 16.27,17.72 14.48,19.51 14.48,23.16 15.58,24.26 15.58,41.44 16,41.86 16,43.57 16.57,44.13 | 16.57,44.13 16.58,44.14
CH340-TX  (via drill 0.3)
  Top/Horz 0.127: v16.98,45.72 17.06,45.8 U2.34 | v7.62,11.8 8.26,11.17 U7.2
  Bottom/Vert 0.127: v7.62,11.8 7.62,12.54 7.98,12.9 15.07,12.9 16.53,14.36 16.53,17.83 14.73,19.62 14.73,23.05 15.84,24.16 15.84,41.33 16.26,41.75 16.26,43.46 16.98,44.19 v16.98,45.72
CHG_LED
  Top/Horz 0.127: R3.2 D1.A
D+
  Top/Horz 0.127: J1.A6 11.18,6.42 11.44,6.68 11.44,6.96 11.69,7.21 U7.5 12.18,7.09 J1.B6
D-  (via drill 0.3)
  Top/Horz 0.127: J1.A7 v11.68,4.83 10.92,4.83 10.68,5.07 J1.B7 | v12.72,8.46 13.34,7.85 U7.6
  Bottom/Vert 0.127: v12.72,8.46 12.46,8.19 12.46,6.44 11.68,5.67 v11.68,4.83
DTR-10K
  Top/Horz 0.127: R17.2 18.04,7.75 17.45,8.34 17.45,9.42 17.68,9.65 Q2.5
ESP_0/QPWR  (via drill 0.3)
  Top/Horz 0.127: S3.3 S3.4 19.9,19.9 v19.94,19.94 | U2.25 19.67,32.29 v18.14,30.76 | v19.86,15.24 16.14,15.24 15.4,14.49 U5.3 | Q2.6 18.57,9 19.1,8.47 v19.48,8.47
  Bottom/Vert 0.127: v18.14,30.76 18.14,30.5 18.71,29.93 18.71,27.64 19.3,27.05 19.3,25.4 19.94,24.77 v19.94,19.94 19.86,19.86 v19.86,15.24 20.32,14.78 TP1.1 20.32,9.4 19.48,8.56 v19.48,8.47
ESP_2/RGB_DI  (via drill 0.3)
  Top/Horz 0.127: v14.22,52.32 14.48,52.58 19.63,52.58 20.07,53.02 20.16,53.02 D5.DI | U2.24 17.14,33.91 16.76,34.29 15.34,34.29 v14.53,35.1
  Bottom/Vert 0.127: v14.22,52.32 14.22,51.69 | 14.22,51.69 14.22,49.52 15.24,48.51 15.24,42.17 14.82,41.75 14.82,38.95 14.53,38.66 v14.53,35.1 | TP3.1 14.22,51.69
ESP_4/TP_FB  (via drill 0.3)
  Top/Horz 0.127: v11.68,51.05 11.86,51.23 15.98,51.23 16.27,51.52 17.09,51.52 17.64,52.07 J5.13 | U2.26 19.33,35.64 18.78,35.09 17.57,35.09 17.28,35.38 15.79,35.38 14.83,36.34 14.13,36.34 v12.85,37.62
  Bottom/Vert 0.127: v12.85,37.62 12.85,42.82 14.22,44.2 14.22,46.74 11.68,49.28 v11.68,51.05
ESP_5/SD_CS  (via drill 0.3)
  Top/Horz 0.127: U2.29 9.96,39.45 v9.14,38.63
  Bottom/Vert 0.127: TP4.1 9.02,38.76 v9.14,38.63 9.14,24.64 6.86,22.35 4.83,22.35 1.02,18.54 1.02,8.89 2.03,7.87 9.4,7.87 9.69,7.58 J2.2
ESP_12/GPIO1
  Top/Horz 0.127: J5.8 1.35,34.37 U2.14
ESP_13/GPIO0/LED
  Top/Horz 0.127: R4.1 7.75,31.11 7.11,31.75 6.99,31.75 | U2.16 6.99,31.75 | 6.99,31.75 J5.9
ESP_14/GPIO6  (via drill 0.3)
  Top/Horz 0.127: U2.13 4.14,35.64 v5.08,36.58
  Bottom/Vert 0.127: v5.08,36.58 4.83,36.83 4.83,46.23 4.06,46.99 J5.3
ESP_15/GPIO4  (via drill 0.3)
  Top/Horz 0.127: U2.23 15.88,33.91 15.75,34.04 14.91,34.04 14.17,34.77 4.85,34.77 v4.57,35.05
  Bottom/Vert 0.127: v4.57,35.05 4.57,40.39 3.05,41.91 J5.5
ESP_16/TP_RX  (via drill 0.3)
  Top/Horz 0.127: v16.51,49.78 13.69,49.78 13.21,50.27 12.98,50.27 v12.95,50.29 | v13.72,37.59 14.22,37.08 18.54,37.08 18.72,36.91 U2.27
  Bottom/Vert 0.127: v16.51,49.78 18.8,49.78 J5.15 | v12.95,50.29 12.95,48.51 14.48,46.99 14.48,44.09 13.21,42.82 13.21,38.1 v13.72,37.59
ESP_17/TP_TX  (via drill 0.3)
  Top/Horz 0.127: v16.51,51.05 | v16.51,51.05 16.22,50.76 v13.75,50.76 | v13.8,38.61 14.06,38.35 16.87,38.35 17.04,38.18 U2.28
  Bottom/Vert 0.127: v16.51,51.05 17.27,51.05 17.78,51.56 19.56,51.56 J5.14 | v13.75,50.76 13.75,48.22 14.73,47.24 14.73,43.69 13.46,42.42 13.46,38.95 v13.8,38.61
ESP_18/TP_SCK  (via drill 0.3)
  Top/Horz 0.127: v16.96,40.13 17.53,40.13 17.78,39.88 18.54,39.88 19.38,40.72 U2.30 21.26,40.72 21.59,40.39 J5.18 | v17.27,6.71 16.37,7.62 16.37,7.89 16.15,8.1 15.65,8.1 15.29,8.46 v14.99,8.46
  Bottom/Vert 0.127: J2.5 12.99,8.04 13.49,8.53 14.25,8.53 14.33,8.46 v14.99,8.46 | v17.27,6.71 18.16,6.71 19,7.54 19,8.65 19.49,9.15 19.49,12.84 18.57,13.77 18.57,17.5 17.34,18.73 17.34,23.77 16.63,24.47 16.63,39.81 v16.96,40.13
ESP_19/TP_POCI  (via drill 0.3)
  Top/Horz 0.127: v18.03,42.93 18.41,42.93 19.35,41.99 U2.31 19.97,41.99 20.78,42.8 20.78,43.64 J5.16
  Bottom/Vert 0.127: v18.03,42.93 16.1,40.99 16.1,24.29 16.83,23.55 16.83,14.79 17.91,13.72 18.24,13.72 18.97,12.98 18.97,12.12 18.29,11.43 18.29,8.33 17.7,7.75 16.12,7.75 15.75,7.37 15.75,7.11 15.53,6.89 J2.7
ESP_21/TP_SDA  (via drill 0.3)
  Top/Horz 0.127: v15.75,44.58 15.79,44.53 U2.33 | v15.75,52.07 15.49,52.32 14.89,52.32 14.41,51.84 5.71,51.84 v5.49,52.07 | J3.3 3.81,8.38 3.05,9.14 3.05,10.41 4.32,11.68 4.32,12.7 5.33,13.72 5.33,14.35 v5.66,14.68 | U4.8 5.6,30.72 5.33,30.99 v5.33,31.24
  Bottom/Vert 0.127: v15.75,52.07 v15.75,44.58 15.49,44.32 15.49,42.07 15.07,41.65 15.07,24.47 13.97,23.37 13.97,19.3 15.75,17.53 15.75,15.97 15.42,15.65 6.63,15.65 v5.66,14.68 | v5.33,31.24 5.33,31.62 5.87,32.16 5.87,51.69 v5.49,52.07 J5.1
ESP_22/TP_SCL  (via drill 0.3)
  Top/Horz 0.127: U4.7 v6.1,30.98 v6.1,30.99 | v5.21,49.53 v6.73,49.53 15.39,49.53 v16.59,48.34 U2.36 | J3.4 5.06,7.37 4.24,7.37 2.77,8.84 2.77,11.88 v3.85,12.96
  Bottom/Vert 0.127: v6.1,30.99 6.12,31.01 6.12,48.92 v6.73,49.53 | v3.85,12.96 5.08,14.2 5.99,14.2 7.18,15.39 15.6,15.39 16.02,15.8 16.02,17.61 14.22,19.41 14.22,23.26 15.33,24.37 15.33,41.54 15.75,41.96 15.75,43.67 16.22,44.14 16.22,44.77 16,44.99 16,47.75 v16.59,48.34 | v5.21,49.53 J5.2
ESP_23/TP_PICO  (via drill 0.3)
  Top/Horz 0.127: v17.02,11.3 16.33,10.62 14,10.62 v11.43,8.05 | v18.49,12.5 18.49,13.01 18.05,13.44 18.05,14.07 17.55,14.58 v17.55,14.76 | v18.29,49.28 18.62,49.61 U2.37
  Bottom/Vert 0.127: J2.3 10.79,7.41 v11.43,8.05 | v17.02,11.3 17.48,11.76 17.75,11.76 v18.49,12.5 | v17.55,14.76 17.5,14.76 17.09,15.17 17.09,23.66 16.38,24.37 16.38,40.51 18.8,42.93 | 18.8,42.93 19.81,41.91 J5.17 | v18.29,49.28 18.29,44.51 18,44.22 18,43.72 18.8,42.93
ESP_25/TP_A1
  Top/Horz 0.127: U2.10 6.17,39.45 8.03,37.59 12.19,37.59 13.7,36.08 14.73,36.08 15.68,35.13 17.17,35.13 18.12,34.19 18.12,31.85 17.67,31.4 17.67,30.34 18.03,29.97 18.29,29.97 J5.23
ESP_26/TP_A0
  Top/Horz 0.127: U2.11 6.29,38.18 7.49,36.98 11.33,36.98 12.74,35.57 14.72,35.57 15.5,34.8 17.02,34.8 17.79,34.03 17.79,32.05 17.78,32.05 17.32,31.59 17.32,30.18 18.03,29.46 18.29,29.46 19.81,27.94 19.81,25.91 J5.24
ESP_27/GPIO2
  Top/Horz 0.127: J5.7 1.35,36.91 U2.12
ESP_32/GPIO5
  Top/Horz 0.127: U2.8 2.87,41.99 1.27,43.59 J5.4
ESP_33/GPIO3
  Top/Horz 0.127: U2.9 2.87,40.72 1.52,39.37 J5.6
ESP_34/TP_A2  (via drill 0.3)
  Top/Horz 0.127: U2.6 4.5,44.53 5.33,45.36 5.33,46.1 5.71,46.48 12.5,46.48 12.95,46.02 12.95,43.27 14.06,42.16 16.36,42.16 17.43,41.09 v17.43,40.89
  Bottom/Vert 0.127: v17.43,40.89 17.43,39.72 17.22,39.51 17.22,32.56 18.8,30.99 18.8,30.48 20.07,29.21 J5.22
ESP_35/TP_A5  (via drill 0.3)
  Top/Horz 0.127: U2.7 4.24,43.26 4.57,42.93 4.57,41.4 5.33,40.64 6.35,40.64 8.89,38.1 13.97,38.1 14.48,37.59 v18.52,37.59
  Bottom/Vert 0.127: v18.52,37.59 19.28,36.83 J5.19
ESP_36/TP_A4  (via drill 0.3)
  Top/Horz 0.127: U2.4 4.4,47.07 5.21,47.88 12.74,47.88 13.97,46.65 13.97,43.69 14.48,43.18 16.4,43.18 v18.5,41.08
  Bottom/Vert 0.127: v18.5,41.08 18.5,39.81 17.73,39.04 17.73,36.47 19.86,34.34 19.91,34.29 J5.20
ESP_39/TP_A3  (via drill 0.3)
  Top/Horz 0.127: U2.5 4.06,45.8 5.18,46.91 12.78,46.91 13.46,46.23 13.46,43.48 14.27,42.67 16.36,42.67 18.01,41.03 18.01,40.48 v18.02,40.46
  Bottom/Vert 0.127: v18.02,40.46 18.02,39.9 17.48,39.36 17.48,34.34 20.07,31.75 J5.21
GND  (via drill 0.3, 0.35)
  Top/Horz 0.127: U4.6 6.6,29.46 U4.9 6.73,29.21 7.1,28.84 U4.4 | J1.GND2 14.99,5.53 14.99,4.83 | D5.GND 21.17,54.99 21.71,54.45 21.71,53.6 21.34,53.23 20.95,53.23 v20.27,52.55 | J1.GND 8.21,5.22 7.97,4.99 7.97,4.93 7.87,4.83
  Top/Horz 0.305: U7.1 7.62,6.58 7.62,6.44 J1.GND 8.21,5.51 | C5.2 21.17,56.69 D5.GND
  other vias: 4.32,16.76 3.81,10.41 5.97,6.45 6.1,1.7 6.17,11.96 15.24,20.7 18.57,22.45 14.61,27.3 14.61,31.11 19.18,27.84 11.18,22.86 7.92,21.06 6.35,21.72 6.35,29.21 4.83,33.02 18.31,50.77 4.45,50.93 14.48,17.27 11.68,2.29 13.97,8.05 16.51,8.46 12.19,14.22 18.92,9.4 17.65,16.76 18.54,18.36 7.62,3.17 4.37,48.82 4.39,47.83 6.88,48.36 11.18,48.36 6.88,47.4 11.18,47.4 6.86,51.05 22.1,50.8 22.1,48.26 20.83,45.72 22.1,43.18 22.1,40.64 20.83,38.1 20.83,35.56 20.83,33.02 20.83,30.48 22.1,27.94 17.53,27.94 12.09,35.31 10.16,35.31 8.13,35.31 2.03,50.8 2.03,48.26 2.03,45.72 0.76,43.18 2.03,40.64 2.03,38.1 6.81,39.5 6.6,36.86 5.33,35.56 2.03,35.56 2.03,33.02 10.41,38.61 12.19,38.86 12.57,36.47 5.33,38.86 2.03,30.48 2.03,27.94 2.29,25.4 1.27,22.61 2.29,18.03 2.46,12.98 3.81,11.94 1.27,7.37 10.16,31.75 7.82,31.72 7.87,29.97 4.32,45.19 11.43,52.32 6.86,52.83 3.3,52.83 19.18,33.4 13.97,40.64 11.94,40.39 6.86,41.66 17.53,43.69 17.78,45.21 17.78,46.48 17.02,49.28 16.76,52.07 14.99,50.29 6.86,43.43 6.86,45.47 5.33,43.43 5.33,40.01 5.33,37.34 4.57,30.23 11.43,19.05 8.13,14.22 21.08,12.45 21.59,8.89 17.93,7.19 1.02,4.83 17.02,5.84 20.83,15.24 20.83,17.78 20.83,20.32 20.83,22.86 17.53,25.4 22.1,25.4 7.62,9.4 9.65,27.94 11.68,17.02 16.56,13.69 4.32,43.92 18.47,41.88 17.78,47.75 18.41,38.84 18.49,44.02 18.52,36.37 17.96,35.56 9.65,24.33 11.68,0.56
  pour Bottom/Vert (isolate 0.152): 0,0 0,53.34 22.86,53.34 22.86,0
  pour Top/Horz (isolate 0.152): 22.86,0 22.86,53.34 0,53.34 0,0
N$1  (via drill 0.3)
  Top/Horz 0.127: R34.1 8.67,27.69 8.42,27.94 7.91,27.94 7.66,28.19 v7.66,28.45
  Bottom/Vert 0.127: JP1.1 8.14,27.56 7.66,28.04 v7.66,28.45
N$2
  Top/Horz 0.127: R4.2 D3.A
N$3  (via drill 0.35)
  Top/Horz 0.127: 22.28,55.84 v22.28,54.86
  Top/Horz 0.305: D5.DO 22.28,55.84
  Bottom/Vert 0.127: TP2.1 21.84,55.3 v22.28,54.86
N$4  (via drill 0.3)
  Top/Horz 0.127: v9.98,30.48 9.14,30.48 8.64,29.97 R3.1
  Bottom/Vert 0.127: JP2.1 10.29,30.18 v9.98,30.48
N$5  (via drill 0.3)
  Top/Horz 0.127: J1.B5 13.18,5.16 v12.96,4.94 | v16.76,4.57 16.51,4.32 R9.2
  Bottom/Vert 0.127: v12.96,4.94 14.35,3.56 15.75,3.56 v16.76,4.57
N$6  (via drill 0.3)
  Top/Horz 0.127: J1.A5 10.18,5.22 v9.91,4.95 | v5.59,3.66 5.61,3.67 R10.2
  Bottom/Vert 0.127: v9.91,4.95 8.61,3.66 v5.59,3.66
N$7  (via drill 0.3)
  Top/Horz 0.127: U1.1 4.6,22.83 v4.57,22.86 | v8.64,28.45 11.68,28.45 11.94,28.19 13.21,28.19 13.46,28.45 13.46,29.2 D1.C
  Bottom/Vert 0.127: v4.57,22.86 6.6,22.86 8.66,24.92 8.66,27.38 8.64,27.41 v8.64,28.45
N$8
  Top/Horz 0.127: J1.SHLD2 J1.SHLD4 J1.SHLD3 J1.SHLD1
  Bottom/Vert 0.305: JP3.2 5.83,5.58 5.84,5.59 6.15,5.28 J1.SHLD1
N$13  (via drill 0.3)
  other vias: 12.83,25.4
N$14
  Top/Horz 0.127: U1.5 5.4,26.57 R6.2
N$30
  Top/Horz 0.127: R34.2 11.59,27.2 D12.A
N$51  (via drill 0.3)
  other vias: 10.92,50.29
QWIIC_PWR  (via drill 0.3)
  Top/Horz 0.305: v3.56,9.4 J3.2 | C3.1 16.54,17.44 U5.5 15.25,16.39 v15.24,16.38
  Bottom/Vert 0.305: v3.56,9.4 3.05,9.91 3.05,13.46 5.97,16.38 v15.24,16.38
RTS-10K
  Top/Horz 0.127: Q2.2 19.46,9.65 19.15,9.96 19.15,11.37 R18.2
TP_EN  (via drill 0.3)
  Top/Horz 0.127: v13.46,23.62 v13.47,23.61 R8.2 12.38,21.77 U3.3 | v5.08,34.29 v13.46,34.29 | J5.11 v3.81,26.67
  Bottom/Vert 0.127: v3.81,26.67 3.81,33.02 v5.08,34.29 | v13.46,34.29 13.46,25.05 12.99,24.58 12.99,24.09 v13.46,23.62
V_BATT
  Top/Horz 0.305: U4.3 6.6,27.68 6.48,27.56 6.1,27.56 | 6.1,27.56 4.94,27.56 4.45,27.06 4.45,24.16 | U4.2 6.1,27.56 | C15.1 7.4,22.93 U1.3
  Top/Horz 0.559: Q3.3 7.53,19.05 J4.2 7.12,18.92 C6.1 7.12,21.6 7.3,21.78 U1.3 7.3,23.66 6.81,24.16 4.45,24.16 1.29,24.16 J5.12
V_USB  (via drill 0.3)
  Top/Horz 0.432: J1.VBUS1 8.98,5.34 9.27,5.05 9.27,4.7 9.78,4.19 v9.93,4.19 13.13,4.19 13.59,4.65 13.59,5.08 13.88,5.37 J1.VBUS2
  Top/Horz 0.559: v6.35,25.4 7.27,25.4 | 7.27,25.4 U1.4 | v2.29,7.11 2.29,8.13 1.78,8.64 v1.78,9.14 | v10.38,26.16 10.08,25.87 C19.1 8.37,25.87 7.9,25.4 7.27,25.4 | 10.31,18.1 v10.38,18.16 | Q3.1 10.31,18.1 | 10.31,18.1 10.28,18.07 D4.A 10.93,15.86 R7.2 | v4.45,29.21 J5.10
  Bottom/Vert 0.559: v4.45,29.21 4.45,27.3 v6.35,25.4 | JP2.2 10.38,28.6 v10.38,26.16 v10.38,18.16 4.19,18.16 3.05,17.02 3.05,15.24 1.78,13.97 v1.78,9.14 | v9.93,4.19 8.21,2.46 5.79,2.46 2.29,5.97 v2.29,7.11
VIN
  Top/Horz 0.305: 13.34,19.94 13.34,16.51 | D4.C 13.34,16.51 | R8.1 13.34,21.73 13.34,19.94 | 13.34,19.94 13.27,20 Q3.2 11.56,20 10.48,21.08 | U5.1 13.82,16.51 13.34,16.51 | U3.1 10.48,21.08 | C7.1 10.4,21.01 10.48,21.08

### Text on the board
Bottom/Vert: v40
tPlace: + | -
Measures: Units in inches
tDocu: Nathan Seidle | Revised by: | Alex Brudner